# Altium project OLED.PrjPcb
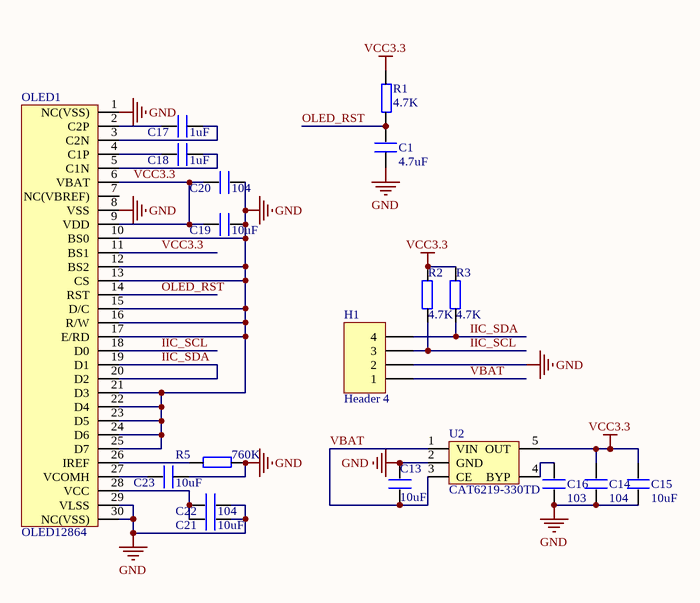
[diagram p0: OLED.SchDoc]
1 sheet, 19 parts. Net scope: global (net labels, ports and power ports of the same name join across sheets).
Board file: OLED.PcbDoc

## Sheet OLED.SchDoc
size A4

### Parts
C1  4.7uF  [C 0603_M]
C13  10uF  [C 0603_M]
C14  104  [C 0603_M]
C15  10uF  [C 0603_M]
C16  103  [C 0603_M]
C17  1uF  [C 0603_M]
C18  1uF  [C 0603_M]
C19  10uF  [C 0603_M]
C20  104  [C 0603_M]
C21  10uF  [C 0603_M]
C22  104  [C 0603_M]
C23  10uF  [C 0603_M]
H1  Header 4  [HDR2.54-LI-4P]
OLED1  OLED12864  [OLED_0.96]
R1  4.7K  [R 0603_M]
R2  4.7K  [R 0603_M]
R3  4.7K  [R 0603_M]
R5  760K  [R 0603_M]
U2  CAT6219-330TD  [SOT-23-5]

### Nets
GND: C1.2 C13.2 C14.1 C15.1 C16.1 C19.1 C20.1 C21.1 C22.1 C23.1 H1.2 OLED1.1(NC(VSS)) OLED1.8(VSS) OLED1.10(BS0) OLED1.12(BS2) OLED1.13(CS) OLED1.15(D/C) OLED1.16(R/W) OLED1.17(E/RD) OLED1.21(D3) OLED1.22(D4) OLED1.23(D5) OLED1.24(D6) OLED1.25(D7) OLED1.29(VLSS) OLED1.30(NC(VSS)) R5.1 U2.2(GND)
VCC3.3: C14.2 C15.2 C19.2 C20.2 OLED1.6(VBAT) OLED1.9(VDD) OLED1.11(BS1) R1.2 R2.1 R3.1 U2.5(OUT)
IIC_SCL: H1.3 OLED1.18(D0) R2.2
IIC_SDA: H1.4 OLED1.19(D1) OLED1.20(D2) R3.2
OLED_RST: C1.1 OLED1.14(RST) R1.1
VBAT: C13.1 H1.1 U2.1(VIN) U2.3(CE)
NetC16_2: C16.2 U2.4(BYP)
NetC17_1: C17.1 OLED1.3(C2N)
NetC17_2: C17.2 OLED1.2(C2P)
NetC18_1: C18.1 OLED1.5(C1N)
NetC18_2: C18.2 OLED1.4(C1P)
NetC21_2: C21.2 C22.2 OLED1.28(VCC)
NetC23_2: C23.2 OLED1.27(VCOMH)
NetOLED1_26: OLED1.26(IREF) R5.2

Not connected (* = marked no-connect by the designer): OLED1 7(NC(VBREF))

### Library data of the parts
C1 C13-C23 = C
H1 = Header 4: Header, 4-Pin; LatestRevisionDate: 17-Jul-2002; LatestRevisionNote: Re-released for DXP Platform.; Publisher: Altium Limited
R1-R3 R5 = R
U2 = CAT6219-330TD: 3.3V 500mA LDO